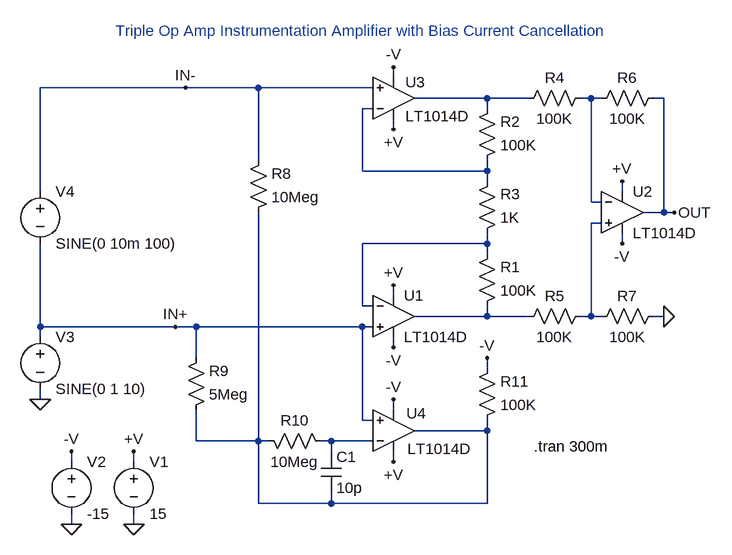
[diagram p0: schematic LT1014D.asc]
LT1014D.asc, the LTspice schematic file:
Version 4
SHEET 1 896 680
WIRE 144 -144 144 -160
WIRE -176 -128 -400 -128
WIRE -64 -128 -176 -128
WIRE 112 -128 -64 -128
WIRE 288 -112 176 -112
WIRE 352 -112 288 -112
WIRE 448 -112 432 -112
WIRE 464 -112 448 -112
WIRE 560 -112 544 -112
WIRE 112 -96 96 -96
WIRE 288 -96 288 -112
WIRE 144 -64 144 -80
WIRE -64 -16 -64 -128
WIRE 96 0 96 -96
WIRE 288 0 288 -16
WIRE 288 0 96 0
WIRE 288 16 288 0
WIRE -400 32 -400 -128
WIRE 496 32 496 16
WIRE 448 48 448 -112
WIRE 464 48 448 48
WIRE 560 64 560 -112
WIRE 560 64 528 64
WIRE 576 64 560 64
WIRE 464 80 448 80
WIRE 288 112 288 96
WIRE 288 112 96 112
WIRE 496 112 496 96
WIRE 288 128 288 112
WIRE 144 192 144 176
WIRE 96 208 96 112
WIRE 112 208 96 208
WIRE 288 224 288 208
WIRE 288 224 176 224
WIRE 352 224 288 224
WIRE 448 224 448 80
WIRE 448 224 432 224
WIRE 464 224 448 224
WIRE 560 224 544 224
WIRE -400 240 -400 112
WIRE -192 240 -400 240
WIRE -160 240 -192 240
WIRE 96 240 -160 240
WIRE 112 240 96 240
WIRE -400 256 -400 240
WIRE 144 272 144 256
WIRE -160 288 -160 240
WIRE 288 304 288 288
WIRE -400 352 -400 336
WIRE 144 368 144 352
WIRE 96 384 96 240
WIRE 112 384 96 384
WIRE 288 400 288 384
WIRE 288 400 176 400
WIRE -160 416 -160 368
WIRE -64 416 -64 64
WIRE -64 416 -160 416
WIRE -48 416 -64 416
WIRE 48 416 32 416
WIRE 112 416 48 416
WIRE 48 432 48 416
WIRE -352 448 -352 432
WIRE -256 448 -256 432
WIRE 144 448 144 432
WIRE -64 512 -64 416
WIRE 48 512 48 496
WIRE 48 512 -64 512
WIRE 288 512 288 400
WIRE 288 512 48 512
WIRE -352 544 -352 528
WIRE -256 544 -256 528
FLAG -256 544 0
FLAG 144 176 +V
FLAG -256 432 +V
FLAG 144 272 -V
FLAG -352 544 0
FLAG -352 432 -V
FLAG -400 352 0
FLAG 144 -64 +V
FLAG 144 -160 -V
FLAG 496 16 +V
FLAG 496 112 -V
FLAG 560 224 0
FLAG 144 448 +V
FLAG 144 352 -V
FLAG 288 288 -V
FLAG 576 64 OUT
FLAG -176 -128 IN-
FLAG -192 240 IN+
SYMBOL voltage -256 432 R0
SYMATTR InstName V1
SYMATTR Value 15
SYMBOL voltage -352 432 R0
SYMATTR InstName V2
SYMATTR Value -15
SYMBOL res 272 224 M180
WINDOW 0 36 76 Left 2
WINDOW 3 36 40 Left 2
SYMATTR InstName R1
SYMATTR Value 100K
SYMBOL res 272 0 M180
WINDOW 0 36 76 Left 2
WINDOW 3 36 40 Left 2
SYMATTR InstName R2
SYMATTR Value 100K
SYMBOL voltage -400 240 R0
SYMATTR InstName V3
SYMATTR Value SINE(0 1 10)
SYMBOL res 272 112 M180
WINDOW 0 36 76 Left 2
WINDOW 3 36 40 Left 2
SYMATTR InstName R3
SYMATTR Value 1K
SYMBOL res 448 -128 R90
WINDOW 0 0 56 VBottom 2
WINDOW 3 32 56 VTop 2
SYMATTR InstName R4
SYMATTR Value 100K
SYMBOL res 448 208 R90
WINDOW 0 0 56 VBottom 2
WINDOW 3 32 56 VTop 2
SYMATTR InstName R5
SYMATTR Value 100K
SYMBOL res 560 -128 R90
WINDOW 0 0 56 VBottom 2
WINDOW 3 32 56 VTop 2
SYMATTR InstName R6
SYMATTR Value 100K
SYMBOL res 560 208 R90
WINDOW 0 0 56 VBottom 2
WINDOW 3 32 56 VTop 2
SYMATTR InstName R7
SYMATTR Value 100K
SYMBOL voltage -400 16 R0
SYMATTR InstName V4
SYMATTR Value SINE(0 10m 100)
SYMBOL res -80 80 M180
WINDOW 0 36 76 Left 2
WINDOW 3 36 40 Left 2
SYMATTR InstName R8
SYMATTR Value 10Meg
SYMBOL res -176 384 M180
WINDOW 0 36 76 Left 2
WINDOW 3 36 40 Left 2
SYMATTR InstName R9
SYMATTR Value 5Meg
SYMBOL res -64 400 M90
WINDOW 0 0 56 VBottom 2
WINDOW 3 32 56 VTop 2
SYMATTR InstName R10
SYMATTR Value 10Meg
SYMBOL cap 32 432 R0
SYMATTR InstName C1
SYMATTR Value 10p
SYMBOL res 272 400 M180
WINDOW 0 36 76 Left 2
WINDOW 3 36 40 Left 2
SYMATTR InstName R11
SYMATTR Value 100K
SYMBOL opamps\\LT1014D 144 160 R0
SYMATTR InstName U1
SYMBOL opamps\\LT1014D 496 0 R0
SYMATTR InstName U2
SYMBOL opamps\\LT1014D 144 -48 M180
WINDOW 0 18 89 Left 2
WINDOW 3 18 36 Left 2
SYMATTR InstName U3
SYMBOL opamps\\LT1014D 144 464 M180
WINDOW 0 20 91 Left 2
WINDOW 3 21 36 Left 2
SYMATTR InstName U4
TEXT 360 424 Left 2 !.tran 300m
TEXT 96 -200 Bottom 2 ;Triple Op Amp Instrumentation Amplifier with Bias Current Cancellation

The netlist it stands for:
* LT1014D.asc
V1 +V 0 15
V2 -V 0 -15
R1 N006 N005 100K
R2 N003 N001 100K
V3 IN+ 0 SINE(0 1 10)
R3 N005 N003 1K
R4 N002 N001 100K
R5 N004 N006 100K
R6 OUT N002 100K
R7 0 N004 100K
V4 IN- IN+ SINE(0 10m 100)
R8 N007 IN- 10Meg
R9 N007 IN+ 5Meg
R10 N007 N008 10Meg
C1 N008 N007 10p
R11 N007 -V 100K
XU1 IN+ N005 +V -V N006 LT1014D  ; pins In+ In- V+ V- OUT
XU2 N004 N002 +V -V OUT LT1014D  ; pins In+ In- V+ V- OUT
XU3 IN- N003 +V -V N001 LT1014D  ; pins In+ In- V+ V- OUT
XU4 IN+ N008 +V -V N007 LT1014D  ; pins In+ In- V+ V- OUT
.tran 300m
* Triple Op Amp Instrumentation Amplifier with Bias Current Cancellation
.backanno
.end